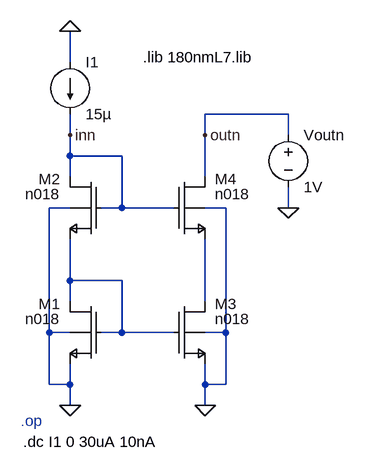
[diagram p0: schematic ogl-cascodaN-MOS.asc]
ogl-cascodaN-MOS.asc, the LTspice schematic file:
Version 4
SHEET 1 1144 696
WIRE -288 96 -288 48
WIRE 48 176 -80 176
WIRE -288 208 -288 176
WIRE -80 208 -80 176
WIRE 48 208 48 176
WIRE -288 240 -288 208
WIRE -208 240 -288 240
WIRE -288 272 -288 240
WIRE -80 272 -80 208
WIRE -288 320 -320 320
WIRE -208 320 -208 240
WIRE -208 320 -240 320
WIRE -128 320 -208 320
WIRE -48 320 -80 320
WIRE 48 320 48 288
WIRE -288 432 -288 368
WIRE -208 432 -288 432
WIRE -288 464 -288 432
WIRE -80 464 -80 368
WIRE -320 512 -320 320
WIRE -288 512 -320 512
WIRE -208 512 -208 432
WIRE -208 512 -240 512
WIRE -128 512 -208 512
WIRE -48 512 -48 320
WIRE -48 512 -80 512
WIRE -320 592 -320 512
WIRE -288 592 -288 560
WIRE -288 592 -320 592
WIRE -80 592 -80 560
WIRE -48 592 -48 512
WIRE -48 592 -80 592
WIRE -288 624 -288 592
WIRE -80 624 -80 592
FLAG -80 624 0
FLAG 48 320 0
FLAG -288 624 0
FLAG -288 48 0
FLAG -288 208 inn
FLAG -80 208 outn
SYMBOL voltage 48 192 R0
WINDOW 123 0 0 Left 2
WINDOW 39 0 0 Left 2
SYMATTR InstName Voutn
SYMATTR Value 1V
SYMBOL nmosb -128 272 R0
SYMATTR InstName M4
SYMATTR Value n018
SYMATTR Value2 l=1u w=2.72u ad=0.54p as=0.54p pd=5.84u ps=5.84u m=1
SYMBOL nmosb -240 272 M0
SYMATTR InstName M2
SYMATTR Value n018
SYMATTR Value2 l=1u w=2.6u ad=0.52p as=0.52p pd=5.6u ps=5.6u m=1
SYMBOL current -288 96 R0
WINDOW 123 0 0 Left 2
WINDOW 39 0 0 Left 2
SYMATTR InstName I1
SYMATTR Value 15µ
SYMBOL nmosb -128 464 R0
SYMATTR InstName M3
SYMATTR Value n018
SYMATTR Value2 l=1u w=2.16u ad=0.43p as=0.43p pd=4.72u ps=4.72u m=1
SYMBOL nmosb -240 464 M0
SYMATTR InstName M1
SYMATTR Value n018
SYMATTR Value2 l=1u w=2.16u ad=0.43p as=0.43p pd=4.72u ps=4.72u m=1
TEXT -176 88 Left 2 !.lib 180nmL7.lib
TEXT -364 648 Left 2 ;.op
TEXT -360 680 Left 2 !.dc I1 0 30uA 10nA

The netlist it stands for:
* ogl-cascodaN-MOS.asc
Voutn outn 0 1V
M4 outn inn N002 0 n018 l=1u w=2.72u ad=0.54p as=0.54p pd=5.84u ps=5.84u m=1
M2 inn inn N001 0 n018 l=1u w=2.6u ad=0.52p as=0.52p pd=5.6u ps=5.6u m=1
I1 0 inn 15µ
M3 N002 N001 0 0 n018 l=1u w=2.16u ad=0.43p as=0.43p pd=4.72u ps=4.72u m=1
M1 N001 N001 0 0 n018 l=1u w=2.16u ad=0.43p as=0.43p pd=4.72u ps=4.72u m=1
.model NMOS NMOS
.model PMOS PMOS
.lib standard.mos
.lib 180nmL7.lib
* .op
.dc I1 0 30uA 10nA
.backanno
.end